# Altium schematic sheet 01-Driver_Board_Overview.SchDoc
size B
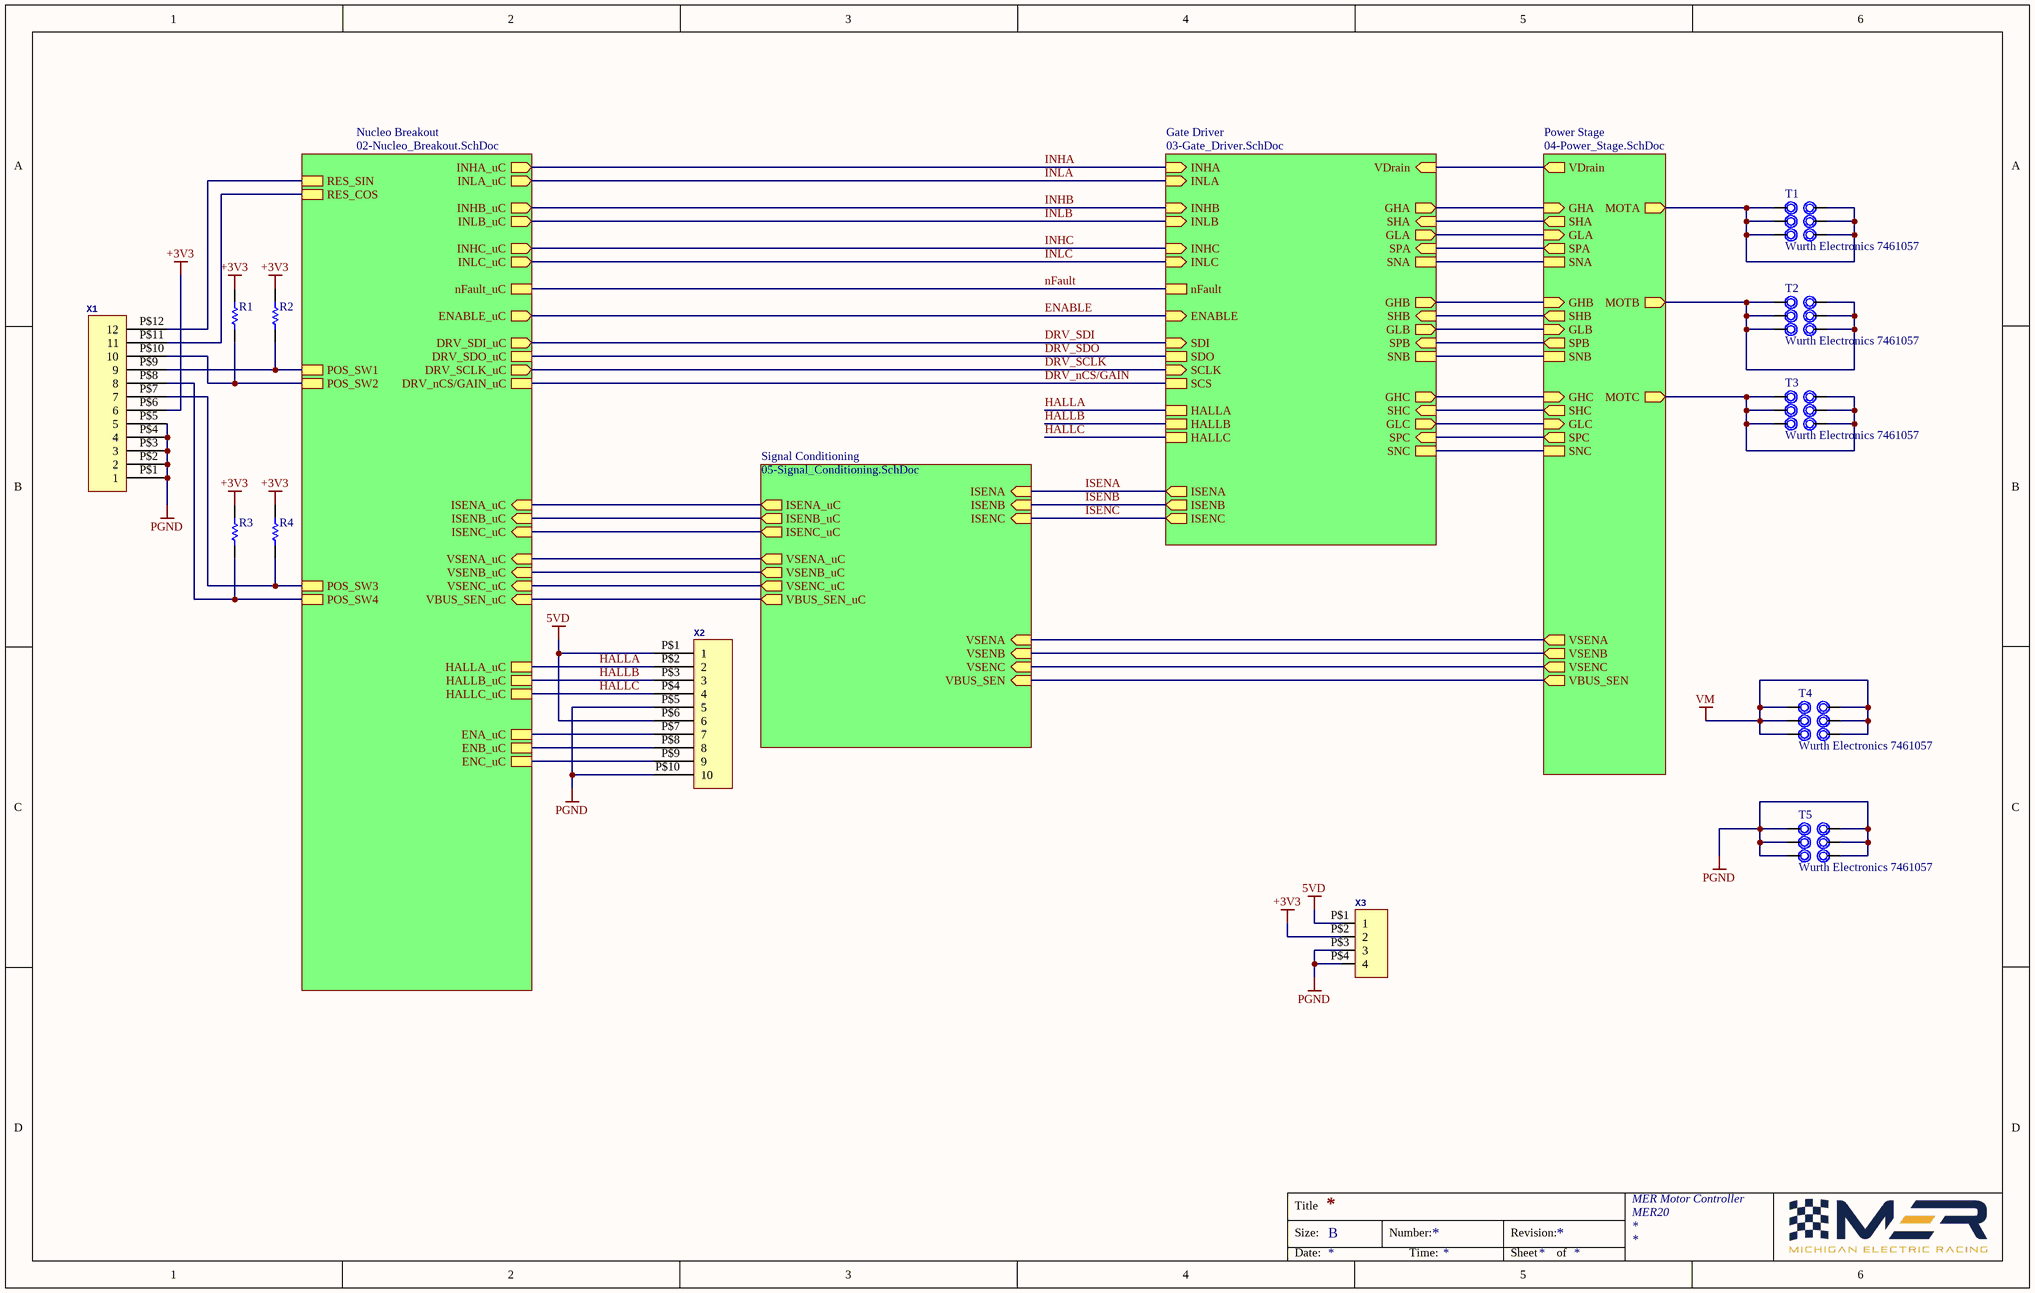
[diagram p0: 01-Driver_Board_Overview.SchDoc]

## Parts
R1  CRCW060347K0JNEA  [RESC1609X50X30ML10T20]  (value not drawn)
R2  CRCW060347K0JNEA  [RESC1609X50X30ML10T20]  (value not drawn)
R3  CRCW060347K0JNEA  [RESC1609X50X30ML10T20]  (value not drawn)
R4  CRCW060347K0JNEA  [RESC1609X50X30ML10T20]  (value not drawn)
T1  Wurth Electronics 7461057  [Redcube 7461057]
T2  Wurth Electronics 7461057  [Redcube 7461057]
T3  Wurth Electronics 7461057  [Redcube 7461057]
T4  Wurth Electronics 7461057  [Redcube 7461057]
T5  Wurth Electronics 7461057  [Redcube 7461057]
X1  Molex - Micro-Fit 3.0 Series connector,  3.00mm (0.118") pitch header, 12 positions.  [43045-1200]  (value not drawn)
X2  Molex - Micro-Fit 3.0 Series connector,  3.00mm (0.118") pitch header, 10 positions.  [43045-1000]  (value not drawn)
X3  Molex - Micro-Fit 3.0 Series connector,  3.00mm (0.118") pitch header, 4 positions.  [43045-0400]  (value not drawn)

## Sub-sheets
Gate Driver = 03-Gate_Driver.SchDoc: ISENB (out), ENABLE (in), GHB (out), GHA (out), ISENA (out), GLC (out), INLB (in), GHC (out), GLB (out), SPB (in), SNB, SHC (in), SNA, SCS, SCLK (in), INHA (in), INHC (in), INLC (in), SNC, INHB (in), SPA (in), SHB (in), nFault, ISENC (out), INLA (in), SDI (in), GLA (out), SHA (in), SPC (in), SDO, VDrain (in), HALLA, HALLB, HALLC
Nucleo Breakout = 02-Nucleo_Breakout.SchDoc: INHA_uC (out), INHB_uC (out), INLB_uC (out), INLA_uC (out), INHC_uC (out), ENABLE_uC (out), nFault_uC, INLC_uC (out), ISENA_uC (in), ISENB_uC (in), ISENC_uC (in), DRV_SDI_uC (out), DRV_SDO_uC, DRV_SCLK_uC (out), DRV_nCS/GAIN_uC, HALLA_uC, HALLC_uC, HALLB_uC, VSENA_uC (in), VSENC_uC (in), VSENB_uC (in), RES_SIN, RES_COS, POS_SW1, POS_SW2, POS_SW3, POS_SW4, ENA_uC, ENC_uC, ENB_uC, VBUS_SEN_uC (in)
Power Stage = 04-Power_Stage.SchDoc: SPB (out), GHC (in), SHA (out), SHC (out), SPC (out), GLC (in), SNC, GHB (in), SHB (out), GLB (in), GLA (in), SPA (out), SNB, GHA (in), SNA, MOTA (out), MOTB (out), MOTC (out), VDrain (out), VSENB (out), VSENC (out), VSENA (out), VBUS_SEN (out)
Signal Conditioning = 05-Signal_Conditioning.SchDoc: VBUS_SEN (in), VSENA (in), VSENB (in), VSENC (in), VSENA_uC (out), VSENB_uC (out), VSENC_uC (out), VBUS_SEN_uC (out), ISENA (in), ISENB (in), ISENC (in), ISENA_uC (out), ISENB_uC (out), ISENC_uC (out)

## Nets
5VD: X2.P$1(1) X2.P$6(6) X3.P$1(1)
+3V3: R1.2 R2.2 R3.2 R4.2 X1.P$6(6) X3.P$2(2)
PGND: T5.1 T5.2 T5.3 T5.4 T5.5 T5.6 X1.P$1(1) X1.P$2(2) X1.P$3(3) X1.P$4(4) X1.P$5(5) X2.P$5(5) X2.P$10(10) X3.P$3(3) X3.P$4(4)
VM: T4.1 T4.2 T4.3 T4.4 T4.5 T4.6
DRV_nCS/GAIN: sheet Gate Driver/SCS, sheet Nucleo Breakout/DRV_nCS/GAIN_uC
DRV_SCLK: sheet Gate Driver/SCLK, sheet Nucleo Breakout/DRV_SCLK_uC
DRV_SDI: sheet Gate Driver/SDI, sheet Nucleo Breakout/DRV_SDI_uC
DRV_SDO: sheet Gate Driver/SDO, sheet Nucleo Breakout/DRV_SDO_uC
ENABLE: sheet Gate Driver/ENABLE, sheet Nucleo Breakout/ENABLE_uC
HALLA: X2.P$2(2) ; sheet Gate Driver/HALLA, sheet Nucleo Breakout/HALLA_uC
HALLB: X2.P$3(3) ; sheet Gate Driver/HALLB, sheet Nucleo Breakout/HALLB_uC
HALLC: X2.P$4(4) ; sheet Gate Driver/HALLC, sheet Nucleo Breakout/HALLC_uC
INHA: sheet Gate Driver/INHA, sheet Nucleo Breakout/INHA_uC
INHB: sheet Gate Driver/INHB, sheet Nucleo Breakout/INHB_uC
INHC: sheet Gate Driver/INHC, sheet Nucleo Breakout/INHC_uC
INLA: sheet Gate Driver/INLA, sheet Nucleo Breakout/INLA_uC
INLB: sheet Gate Driver/INLB, sheet Nucleo Breakout/INLB_uC
INLC: sheet Gate Driver/INLC, sheet Nucleo Breakout/INLC_uC
ISENA: sheet Gate Driver/ISENA, sheet Signal Conditioning/ISENA
ISENB: sheet Gate Driver/ISENB, sheet Signal Conditioning/ISENB
ISENC: sheet Gate Driver/ISENC, sheet Signal Conditioning/ISENC
nFault: sheet Gate Driver/nFault, sheet Nucleo Breakout/nFault_uC
NetR1_1: R1.1 X1.P$10(10) ; sheet Nucleo Breakout/POS_SW2
NetR2_1: R2.1 X1.P$9(9) ; sheet Nucleo Breakout/POS_SW1
NetR3_1: R3.1 X1.P$8(8) ; sheet Nucleo Breakout/POS_SW4
NetR4_1: R4.1 X1.P$7(7) ; sheet Nucleo Breakout/POS_SW3
NetT1_1: T1.1 T1.2 T1.3 T1.4 T1.5 T1.6 ; sheet Power Stage/MOTA
NetT2_1: T2.1 T2.2 T2.3 T2.4 T2.5 T2.6 ; sheet Power Stage/MOTB
NetT3_1: T3.1 T3.2 T3.3 T3.4 T3.5 T3.6 ; sheet Power Stage/MOTC
NetX1_P$11: X1.P$11(11) ; sheet Nucleo Breakout/RES_COS
NetX1_P$12: X1.P$12(12) ; sheet Nucleo Breakout/RES_SIN
NetX2_P$7: X2.P$7(7) ; sheet Nucleo Breakout/ENA_uC
NetX2_P$8: X2.P$8(8) ; sheet Nucleo Breakout/ENB_uC
NetX2_P$9: X2.P$9(9) ; sheet Nucleo Breakout/ENC_uC
(unnamed): sheet Gate Driver/GHB, sheet Power Stage/GHB
(unnamed): sheet Gate Driver/GHA, sheet Power Stage/GHA
(unnamed): sheet Gate Driver/GLC, sheet Power Stage/GLC
(unnamed): sheet Gate Driver/GHC, sheet Power Stage/GHC
(unnamed): sheet Gate Driver/GLB, sheet Power Stage/GLB
(unnamed): sheet Gate Driver/SPB, sheet Power Stage/SPB
(unnamed): sheet Gate Driver/SNB, sheet Power Stage/SNB
(unnamed): sheet Gate Driver/SHC, sheet Power Stage/SHC
(unnamed): sheet Gate Driver/SNA, sheet Power Stage/SNA
(unnamed): sheet Gate Driver/SNC, sheet Power Stage/SNC
(unnamed): sheet Gate Driver/SPA, sheet Power Stage/SPA
(unnamed): sheet Gate Driver/SHB, sheet Power Stage/SHB
(unnamed): sheet Gate Driver/GLA, sheet Power Stage/GLA
(unnamed): sheet Gate Driver/SHA, sheet Power Stage/SHA
(unnamed): sheet Gate Driver/SPC, sheet Power Stage/SPC
(unnamed): sheet Gate Driver/VDrain, sheet Power Stage/VDrain
(unnamed): sheet Signal Conditioning/VBUS_SEN, sheet Power Stage/VBUS_SEN
(unnamed): sheet Signal Conditioning/VSENA, sheet Power Stage/VSENA
(unnamed): sheet Signal Conditioning/VSENB, sheet Power Stage/VSENB
(unnamed): sheet Signal Conditioning/VSENC, sheet Power Stage/VSENC
(unnamed): sheet Signal Conditioning/VSENA_uC, sheet Nucleo Breakout/VSENA_uC
(unnamed): sheet Signal Conditioning/VSENB_uC, sheet Nucleo Breakout/VSENB_uC
(unnamed): sheet Signal Conditioning/VSENC_uC, sheet Nucleo Breakout/VSENC_uC
(unnamed): sheet Signal Conditioning/VBUS_SEN_uC, sheet Nucleo Breakout/VBUS_SEN_uC
(unnamed): sheet Signal Conditioning/ISENA_uC, sheet Nucleo Breakout/ISENA_uC
(unnamed): sheet Signal Conditioning/ISENB_uC, sheet Nucleo Breakout/ISENB_uC
(unnamed): sheet Signal Conditioning/ISENC_uC, sheet Nucleo Breakout/ISENC_uC

## Notes on the sheet
- Title
- Size:
- B
- Number:
- Revision:
- MER Motor Controller
- MER20
- Date:
- Time:
- Sheet
- of

## Library data of the parts
R1-R4 = CMP-2000-03381-1: Manufacturer: Vishay Dale; Part Number: CRCW060347K0JNEA
T1-T5 = Redcube 7461057: Screw Terminal; Supplier 1: Digi-Key; Supplier 2: Mouser
X1 = HEADER_POS12_?43045-1200: GateName_1: G$1; SymbolName_1: HEADER_POS12; DeviceName: 43045-1200; LibraryName: con-molex-micro-fit-3_0_2; DeviceSetName: HEADER_POS12_?; Package: 43045-1200
X2 = HEADER_POS10_?43045-1000: GateName_1: G$1; SymbolName_1: HEADER_POS10; DeviceName: 43045-1000; LibraryName: con-molex-micro-fit-3_0_2; DeviceSetName: HEADER_POS10_?; Package: 43045-1000
X3 = HEADER_POS4_?43045-0401: GateName_1: G$1; SymbolName_1: HEADER_POS4; DeviceName: 43045-0401; LibraryName: con-molex-micro-fit-3_0_2; DeviceSetName: HEADER_POS4_?; Package: 43045-0400